# EAGLE schematic blank_module (EAGLE 6.5.0)
AUTHOR: <Your Name>; REV: A; TITLE: <Module Title>
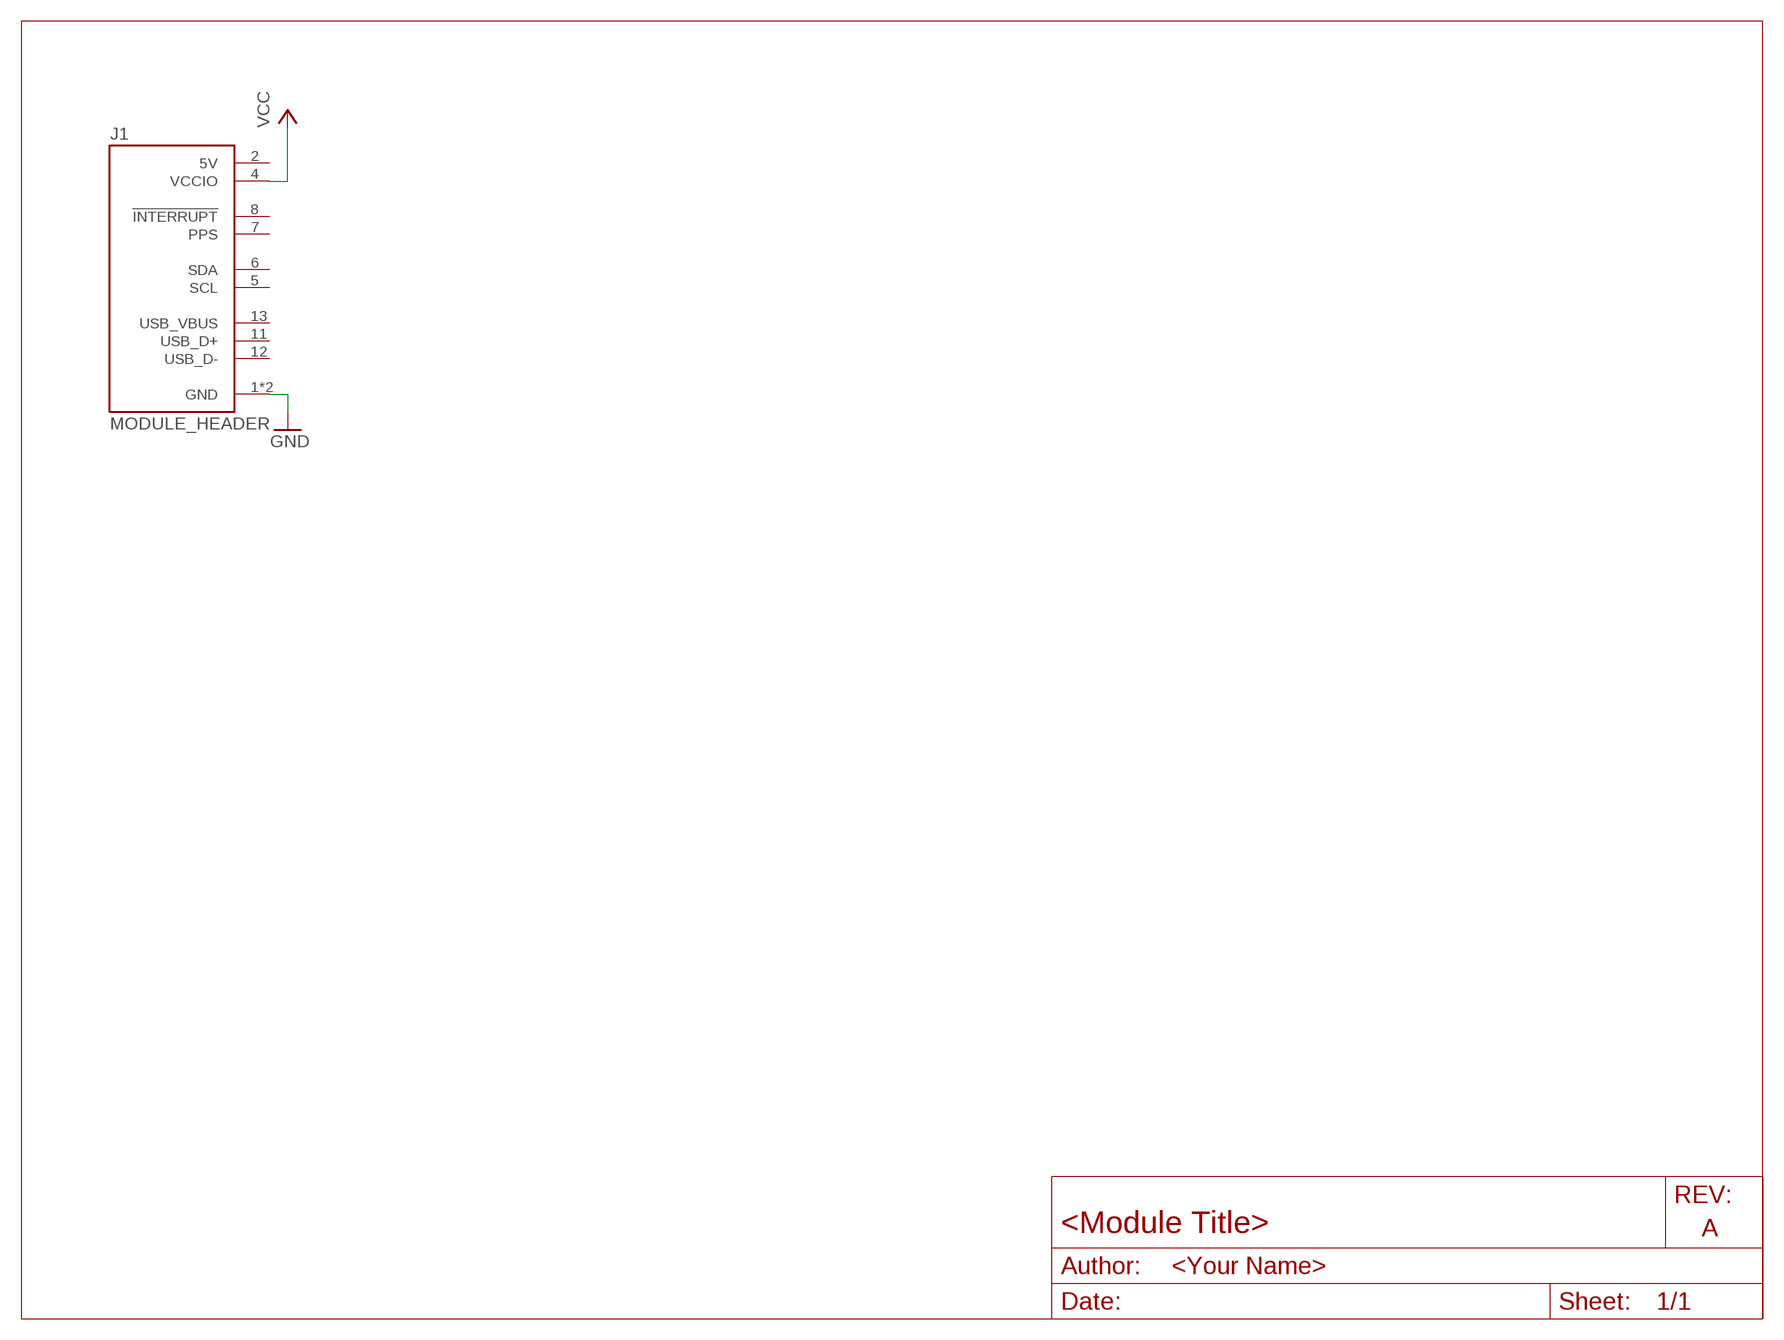
[diagram p0: schematic, sheet 1]

## Parts
J1  MODULE_HEADER  [HEADER_14PIN]

## Nets
GND: J1.1(GND) J1.14(GND)
VCC: J1.4(VCCIO)
Unconnected: J1.2(5V) J1.5(SCL) J1.6(SDA) J1.7(PPS) J1.8(!INTERRUPT) J1.11(USB_D+) J1.12(USB_D-) J1.13(USB_VBUS)

## Library data of the parts
J1 = signpost:MODULE_HEADER: Header for signpost modules; DIGIKEY: S9170-ND